# Altium schematic sheet Top_Level.SchDoc
size Letter
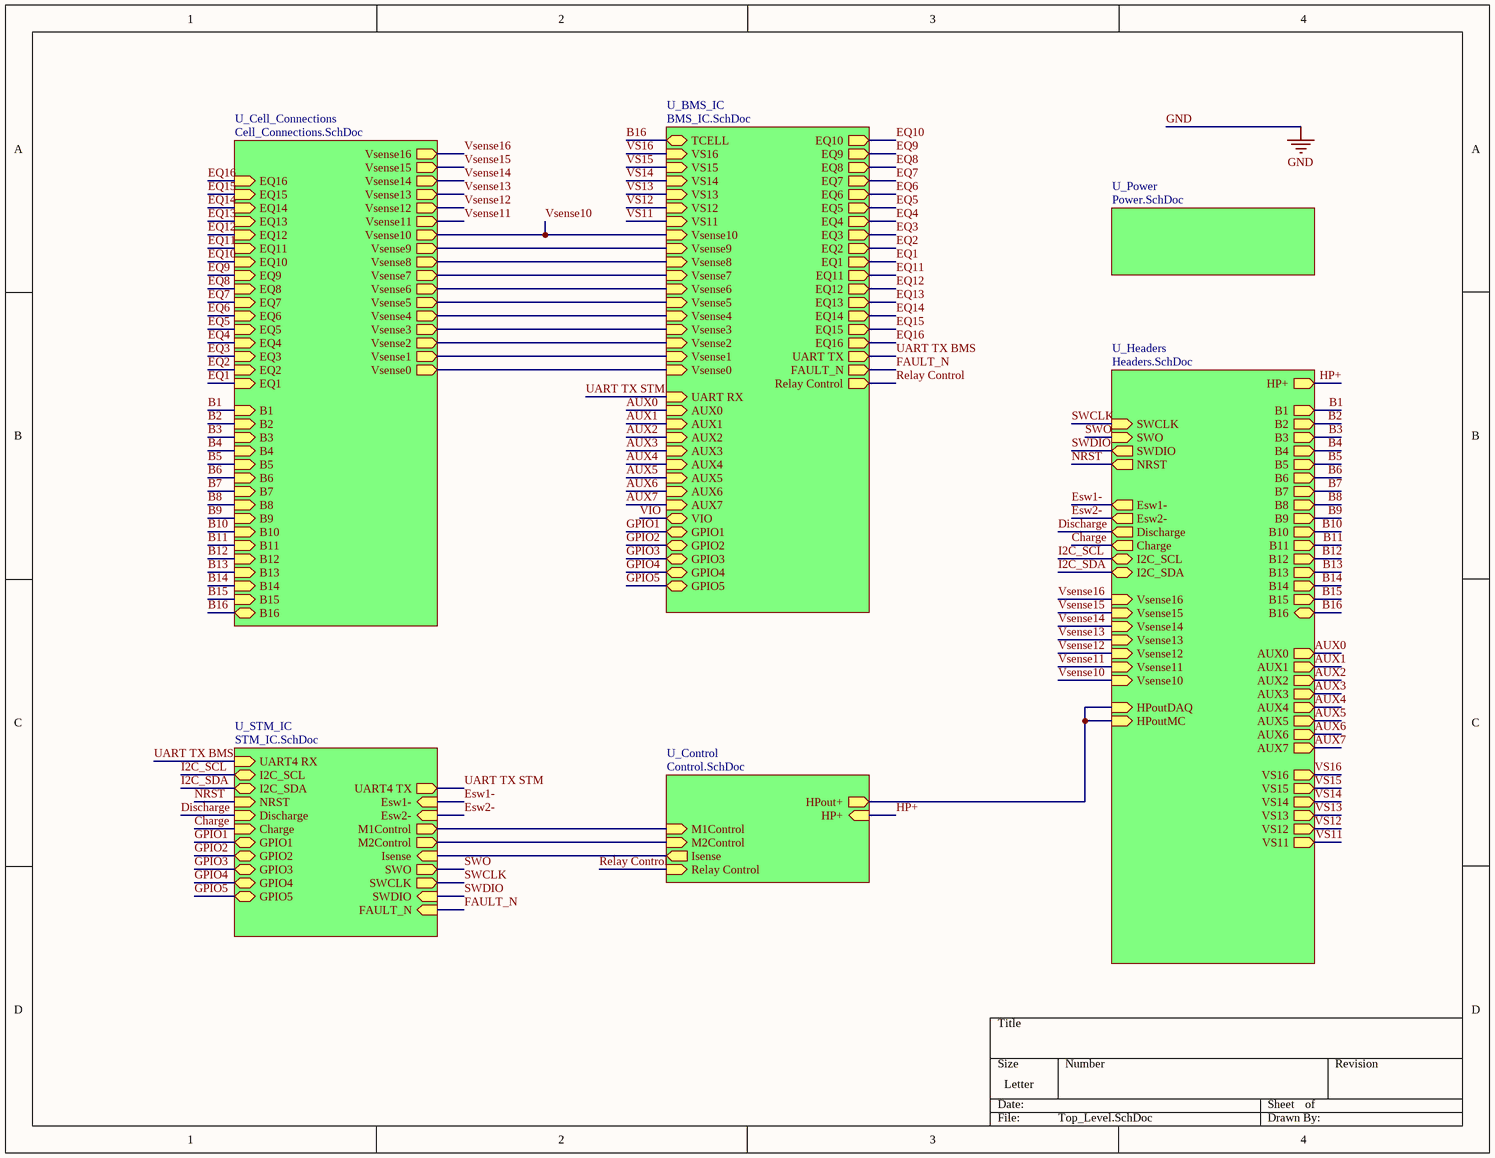
[diagram p0: Top_Level.SchDoc]

## Sub-sheets
U_BMS_IC = BMS_IC.SchDoc: Vsense10 (in), EQ10 (out), EQ9 (out), EQ8 (out), EQ7 (out), EQ6 (out), EQ5 (out), EQ4 (out), EQ3 (out), EQ2 (out), EQ1 (out), Vsense9 (in), Vsense8 (in), Vsense7 (in), Vsense6 (in), Vsense5 (in), Vsense4 (in), Vsense3 (in), Vsense2 (in), Vsense1 (in), Vsense0 (in), EQ11 (out), EQ12 (out), EQ13 (out), EQ14 (out), EQ15 (out), EQ16 (out), UART TX (out), UART RX (in), FAULT_N (out), AUX0 (in), AUX1 (in), AUX2 (in), AUX3 (in), AUX4 (in), AUX5 (in), AUX6 (in), AUX7 (in), VIO (bidir), GPIO1 (bidir), GPIO2 (bidir), GPIO3 (bidir), GPIO4 (bidir), GPIO5 (bidir), Relay Control (out), TCELL (bidir), VS11 (in), VS12 (in), VS15 (in), VS16 (in), VS13 (in), VS14 (in)
U_Cell_Connections = Cell_Connections.SchDoc: Vsense16 (out), Vsense15 (out), Vsense14 (out), EQ16 (in), EQ15 (in), EQ14 (in), Vsense13 (out), EQ13 (in), EQ12 (in), EQ11 (in), EQ10 (in), Vsense9 (out), Vsense10 (out), Vsense11 (out), Vsense12 (out), EQ9 (in), Vsense8 (out), EQ8 (in), Vsense7 (out), EQ7 (in), Vsense6 (out), EQ6 (in), Vsense5 (out), EQ5 (in), Vsense4 (out), EQ4 (in), Vsense3 (out), EQ3 (in), Vsense2 (out), EQ2 (in), Vsense1 (out), EQ1 (in), Vsense0 (out), B1 (in), B2 (in), B3 (in), B4 (in), B5 (in), B6 (in), B7 (in), B8 (in), B9 (in), B10 (in), B11 (in), B12 (in), B13 (in), B14 (in), B15 (in), B16 (bidir)
U_Control = Control.SchDoc: Isense (out), M2Control (in), M1Control (in), HP+ (in), HPout+ (out), Relay Control (in)
U_Headers = Headers.SchDoc: HP+ (out), B1 (out), B2 (out), B3 (out), B4 (out), B5 (out), B6 (out), B7 (out), B8 (out), B9 (out), B10 (out), B11 (out), B12 (out), B13 (out), B14 (out), B15 (out), B16 (bidir), SWDIO (out), SWCLK (in), SWO (in), NRST (out), AUX0 (out), AUX1 (out), AUX2 (out), AUX3 (out), AUX4 (out), AUX5 (out), AUX6 (out), AUX7 (out), Esw1- (out), Esw2- (out), Discharge (out), Charge (out), I2C_SCL (bidir), I2C_SDA (bidir), VS11 (out), VS16 (out), Vsense11 (in), Vsense16 (in), Vsense10 (in), Vsense14 (in), Vsense13 (in), VS13 (out), Vsense12 (in), VS14 (out), VS12 (out), Vsense15 (in), VS15 (out), HPoutDAQ (in), HPoutMC (in)
U_Power = Power.SchDoc: no entries
U_STM_IC = STM_IC.SchDoc: UART4 TX (out), UART4 RX (in), I2C_SCL (bidir), I2C_SDA (bidir), NRST (in), Esw1- (in), Esw2- (in), SWO (out), SWDIO (in), SWCLK (out), Discharge (in), Charge (in), GPIO1 (bidir), GPIO2 (bidir), GPIO3 (bidir), GPIO4 (bidir), GPIO5 (bidir), Isense (in), M1Control (out), M2Control (out), FAULT_N (in)

## Nets
AUX0: sheet U_BMS_IC/AUX0, sheet U_Headers/AUX0
AUX1: sheet U_BMS_IC/AUX1, sheet U_Headers/AUX1
AUX2: sheet U_BMS_IC/AUX2, sheet U_Headers/AUX2
AUX3: sheet U_BMS_IC/AUX3, sheet U_Headers/AUX3
AUX4: sheet U_BMS_IC/AUX4, sheet U_Headers/AUX4
AUX5: sheet U_BMS_IC/AUX5, sheet U_Headers/AUX5
AUX6: sheet U_BMS_IC/AUX6, sheet U_Headers/AUX6
AUX7: sheet U_BMS_IC/AUX7, sheet U_Headers/AUX7
B1: sheet U_Cell_Connections/B1, sheet U_Headers/B1
B2: sheet U_Cell_Connections/B2, sheet U_Headers/B2
B3: sheet U_Cell_Connections/B3, sheet U_Headers/B3
B4: sheet U_Cell_Connections/B4, sheet U_Headers/B4
B5: sheet U_Cell_Connections/B5, sheet U_Headers/B5
B6: sheet U_Cell_Connections/B6, sheet U_Headers/B6
B7: sheet U_Cell_Connections/B7, sheet U_Headers/B7
B8: sheet U_Cell_Connections/B8, sheet U_Headers/B8
B9: sheet U_Cell_Connections/B9, sheet U_Headers/B9
B10: sheet U_Cell_Connections/B10, sheet U_Headers/B10
B11: sheet U_Cell_Connections/B11, sheet U_Headers/B11
B12: sheet U_Cell_Connections/B12, sheet U_Headers/B12
B13: sheet U_Cell_Connections/B13, sheet U_Headers/B13
B14: sheet U_Cell_Connections/B14, sheet U_Headers/B14
B15: sheet U_Cell_Connections/B15, sheet U_Headers/B15
B16: sheet U_BMS_IC/TCELL, sheet U_Cell_Connections/B16, sheet U_Headers/B16
Charge: sheet U_STM_IC/Charge, sheet U_Headers/Charge
Discharge: sheet U_STM_IC/Discharge, sheet U_Headers/Discharge
EQ1: sheet U_BMS_IC/EQ1, sheet U_Cell_Connections/EQ1
EQ2: sheet U_BMS_IC/EQ2, sheet U_Cell_Connections/EQ2
EQ3: sheet U_BMS_IC/EQ3, sheet U_Cell_Connections/EQ3
EQ4: sheet U_BMS_IC/EQ4, sheet U_Cell_Connections/EQ4
EQ5: sheet U_BMS_IC/EQ5, sheet U_Cell_Connections/EQ5
EQ6: sheet U_BMS_IC/EQ6, sheet U_Cell_Connections/EQ6
EQ7: sheet U_BMS_IC/EQ7, sheet U_Cell_Connections/EQ7
EQ8: sheet U_BMS_IC/EQ8, sheet U_Cell_Connections/EQ8
EQ9: sheet U_BMS_IC/EQ9, sheet U_Cell_Connections/EQ9
EQ10: sheet U_BMS_IC/EQ10, sheet U_Cell_Connections/EQ10
EQ11: sheet U_BMS_IC/EQ11, sheet U_Cell_Connections/EQ11
EQ12: sheet U_BMS_IC/EQ12, sheet U_Cell_Connections/EQ12
EQ13: sheet U_BMS_IC/EQ13, sheet U_Cell_Connections/EQ13
EQ14: sheet U_BMS_IC/EQ14, sheet U_Cell_Connections/EQ14
EQ15: sheet U_BMS_IC/EQ15, sheet U_Cell_Connections/EQ15
EQ16: sheet U_BMS_IC/EQ16, sheet U_Cell_Connections/EQ16
Esw1-: sheet U_STM_IC/Esw1-, sheet U_Headers/Esw1-
Esw2-: sheet U_STM_IC/Esw2-, sheet U_Headers/Esw2-
FAULT_N: sheet U_BMS_IC/FAULT_N, sheet U_STM_IC/FAULT_N
GPIO1: sheet U_BMS_IC/GPIO1, sheet U_STM_IC/GPIO1
GPIO2: sheet U_BMS_IC/GPIO2, sheet U_STM_IC/GPIO2
GPIO3: sheet U_BMS_IC/GPIO3, sheet U_STM_IC/GPIO3
GPIO4: sheet U_BMS_IC/GPIO4, sheet U_STM_IC/GPIO4
GPIO5: sheet U_BMS_IC/GPIO5, sheet U_STM_IC/GPIO5
HP+: sheet U_Headers/HP+, sheet U_Control/HP+
I2C_SCL: sheet U_STM_IC/I2C_SCL, sheet U_Headers/I2C_SCL
I2C_SDA: sheet U_STM_IC/I2C_SDA, sheet U_Headers/I2C_SDA
NRST: sheet U_STM_IC/NRST, sheet U_Headers/NRST
Relay Control: sheet U_BMS_IC/Relay Control, sheet U_Control/Relay Control
SWCLK: sheet U_STM_IC/SWCLK, sheet U_Headers/SWCLK
SWDIO: sheet U_STM_IC/SWDIO, sheet U_Headers/SWDIO
SWO: sheet U_STM_IC/SWO, sheet U_Headers/SWO
UART TX BMS: sheet U_BMS_IC/UART TX, sheet U_STM_IC/UART4 RX
UART TX STM: sheet U_BMS_IC/UART RX, sheet U_STM_IC/UART4 TX
VIO: sheet U_BMS_IC/VIO
VS11: sheet U_BMS_IC/VS11, sheet U_Headers/VS11
VS12: sheet U_BMS_IC/VS12, sheet U_Headers/VS12
VS13: sheet U_BMS_IC/VS13, sheet U_Headers/VS13
VS14: sheet U_BMS_IC/VS14, sheet U_Headers/VS14
VS15: sheet U_BMS_IC/VS15, sheet U_Headers/VS15
VS16: sheet U_BMS_IC/VS16, sheet U_Headers/VS16
Vsense10: sheet U_BMS_IC/Vsense10, sheet U_Cell_Connections/Vsense10, sheet U_Headers/Vsense10
Vsense11: sheet U_Cell_Connections/Vsense11, sheet U_Headers/Vsense11
Vsense12: sheet U_Cell_Connections/Vsense12, sheet U_Headers/Vsense12
Vsense13: sheet U_Cell_Connections/Vsense13, sheet U_Headers/Vsense13
Vsense14: sheet U_Cell_Connections/Vsense14, sheet U_Headers/Vsense14
Vsense15: sheet U_Cell_Connections/Vsense15, sheet U_Headers/Vsense15
Vsense16: sheet U_Cell_Connections/Vsense16, sheet U_Headers/Vsense16
(unnamed): sheet U_BMS_IC/Vsense9, sheet U_Cell_Connections/Vsense9
(unnamed): sheet U_BMS_IC/Vsense8, sheet U_Cell_Connections/Vsense8
(unnamed): sheet U_BMS_IC/Vsense7, sheet U_Cell_Connections/Vsense7
(unnamed): sheet U_BMS_IC/Vsense6, sheet U_Cell_Connections/Vsense6
(unnamed): sheet U_BMS_IC/Vsense5, sheet U_Cell_Connections/Vsense5
(unnamed): sheet U_BMS_IC/Vsense4, sheet U_Cell_Connections/Vsense4
(unnamed): sheet U_BMS_IC/Vsense3, sheet U_Cell_Connections/Vsense3
(unnamed): sheet U_BMS_IC/Vsense2, sheet U_Cell_Connections/Vsense2
(unnamed): sheet U_BMS_IC/Vsense1, sheet U_Cell_Connections/Vsense1
(unnamed): sheet U_BMS_IC/Vsense0, sheet U_Cell_Connections/Vsense0
(unnamed): sheet U_STM_IC/Isense, sheet U_Control/Isense
(unnamed): sheet U_STM_IC/M1Control, sheet U_Control/M1Control
(unnamed): sheet U_STM_IC/M2Control, sheet U_Control/M2Control
(unnamed): sheet U_Headers/HPoutDAQ, sheet U_Headers/HPoutMC, sheet U_Control/HPout+